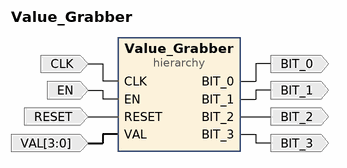
[diagram p0: block diagram of the top level]
# Vivado block design Value_Grabber, xc7a35tcpg236-1, Vivado 2018.3
create_bd_design Value_Grabber

create_bd_port -dir I -from 3 -to 0 VAL
create_bd_port -dir I RESET
create_bd_port -dir I EN
create_bd_port -dir I CLK
create_bd_port -dir O BIT_0
create_bd_port -dir O BIT_1
create_bd_port -dir O BIT_2
create_bd_port -dir O BIT_3

create_bd_cell -type hier Value_Grabber

# ---- hierarchy /Value_Grabber ----
current_bd_instance /Value_Grabber
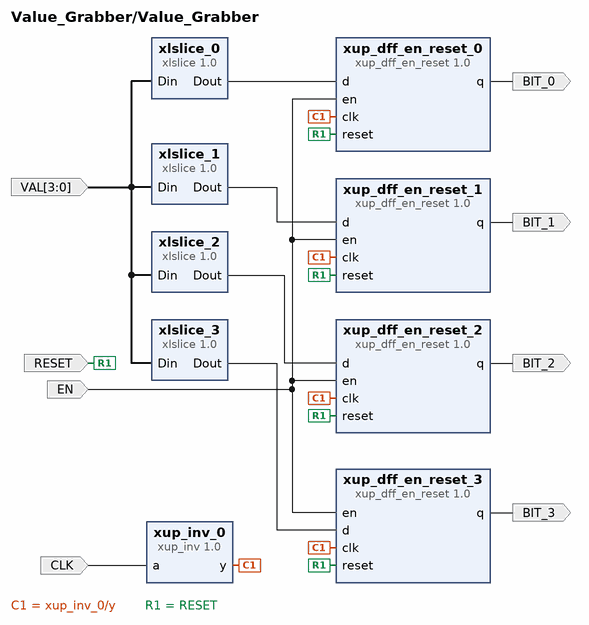
[diagram p1: block diagram inside /Value_Grabber]
create_bd_pin -dir I CLK
create_bd_pin -dir I EN
create_bd_pin -dir I RESET
create_bd_pin -dir O BIT_0
create_bd_pin -dir I -from 3 -to 0 VAL
create_bd_pin -dir O BIT_1
create_bd_pin -dir O BIT_2
create_bd_pin -dir O BIT_3

create_bd_cell -type ip -vlnv xilinx.com:xup:xup_dff_en_reset:1.0 xup_dff_en_reset_0
set_property -dict {CONFIG.DELAY 0} [get_bd_cells xup_dff_en_reset_0]
create_bd_cell -type ip -vlnv xilinx.com:ip:xlslice:1.0 xlslice_0
set_property -dict {CONFIG.DIN_FROM 0 CONFIG.DIN_TO 0 CONFIG.DIN_WIDTH 4} [get_bd_cells xlslice_0]
create_bd_cell -type ip -vlnv xilinx.com:xup:xup_dff_en_reset:1.0 xup_dff_en_reset_1
set_property -dict {CONFIG.DELAY 0} [get_bd_cells xup_dff_en_reset_1]
create_bd_cell -type ip -vlnv xilinx.com:ip:xlslice:1.0 xlslice_1
set_property -dict {CONFIG.DIN_FROM 1 CONFIG.DIN_TO 1 CONFIG.DIN_WIDTH 4 CONFIG.DOUT_WIDTH 1} [get_bd_cells xlslice_1]
create_bd_cell -type ip -vlnv xilinx.com:xup:xup_dff_en_reset:1.0 xup_dff_en_reset_2
set_property -dict {CONFIG.DELAY 0} [get_bd_cells xup_dff_en_reset_2]
create_bd_cell -type ip -vlnv xilinx.com:ip:xlslice:1.0 xlslice_2
set_property -dict {CONFIG.DIN_FROM 2 CONFIG.DIN_TO 2 CONFIG.DIN_WIDTH 4 CONFIG.DOUT_WIDTH 1} [get_bd_cells xlslice_2]
create_bd_cell -type ip -vlnv xilinx.com:xup:xup_dff_en_reset:1.0 xup_dff_en_reset_3
set_property -dict {CONFIG.DELAY 0} [get_bd_cells xup_dff_en_reset_3]
create_bd_cell -type ip -vlnv xilinx.com:ip:xlslice:1.0 xlslice_3
set_property -dict {CONFIG.DIN_FROM 3 CONFIG.DIN_TO 3 CONFIG.DIN_WIDTH 4 CONFIG.DOUT_WIDTH 1} [get_bd_cells xlslice_3]
create_bd_cell -type ip -vlnv xilinx.com:xup:xup_inv:1.0 xup_inv_0
set_property -dict {CONFIG.DELAY 0} [get_bd_cells xup_inv_0]

# ---- connections ----

current_bd_instance /Value_Grabber
connect_bd_net [get_bd_pins xlslice_0/Dout] [get_bd_pins xup_dff_en_reset_0/d]
connect_bd_net [get_bd_pins xlslice_1/Dout] [get_bd_pins xup_dff_en_reset_1/d]
connect_bd_net [get_bd_pins xlslice_2/Dout] [get_bd_pins xup_dff_en_reset_2/d]
connect_bd_net [get_bd_pins xlslice_3/Dout] [get_bd_pins xup_dff_en_reset_3/d]
connect_bd_net [get_bd_pins xup_inv_0/y] \
  [get_bd_pins xup_dff_en_reset_1/clk] [get_bd_pins xup_dff_en_reset_2/clk] [get_bd_pins xup_dff_en_reset_3/clk] \
  [get_bd_pins xup_dff_en_reset_0/clk]
connect_bd_net [get_bd_pins EN] \
  [get_bd_pins xup_dff_en_reset_1/en] [get_bd_pins xup_dff_en_reset_2/en] [get_bd_pins xup_dff_en_reset_3/en] \
  [get_bd_pins xup_dff_en_reset_0/en]
connect_bd_net [get_bd_pins RESET] \
  [get_bd_pins xup_dff_en_reset_1/reset] [get_bd_pins xup_dff_en_reset_2/reset] [get_bd_pins xup_dff_en_reset_3/reset] \
  [get_bd_pins xup_dff_en_reset_0/reset]
connect_bd_net [get_bd_pins xup_dff_en_reset_0/q] [get_bd_pins BIT_0]
connect_bd_net [get_bd_pins VAL] [get_bd_pins xlslice_1/Din] [get_bd_pins xlslice_2/Din] [get_bd_pins xlslice_3/Din] [get_bd_pins xlslice_0/Din]
connect_bd_net [get_bd_pins xup_dff_en_reset_1/q] [get_bd_pins BIT_1]
connect_bd_net [get_bd_pins xup_dff_en_reset_2/q] [get_bd_pins BIT_2]
connect_bd_net [get_bd_pins xup_dff_en_reset_3/q] [get_bd_pins BIT_3]
connect_bd_net [get_bd_pins CLK] [get_bd_pins xup_inv_0/a]

current_bd_instance /
connect_bd_net -net xup_dff_en_reset_0_q [get_bd_pins Value_Grabber/BIT_0] [get_bd_ports BIT_0]
connect_bd_net -net xup_dff_en_reset_2_q [get_bd_pins Value_Grabber/BIT_2] [get_bd_ports BIT_2]
connect_bd_net -net xup_dff_en_reset_1_q [get_bd_pins Value_Grabber/BIT_1] [get_bd_ports BIT_1]
connect_bd_net -net xup_dff_en_reset_3_q [get_bd_pins Value_Grabber/BIT_3] [get_bd_ports BIT_3]
connect_bd_net [get_bd_ports CLK] [get_bd_pins Value_Grabber/CLK]
connect_bd_net [get_bd_ports EN] [get_bd_pins Value_Grabber/EN]
connect_bd_net [get_bd_ports RESET] [get_bd_pins Value_Grabber/RESET]
connect_bd_net [get_bd_ports VAL] [get_bd_pins Value_Grabber/VAL]

validate_bd_design
save_bd_design
